# Altium schematic sheet preamp_chanel2_normal.SchDoc
size A4
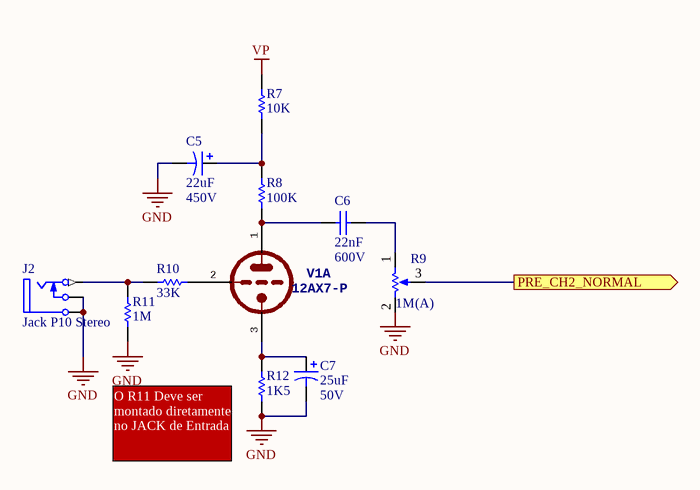
[diagram p0: preamp_chanel2_normal.SchDoc]

## Parts
C5  value 22uF  Voltage: 450V  [RAD-POL-7.6-15]  (hidden comment: Cap Pol Rad)
C6  value 22nF  Voltage: 600V  [ORANGE-DROP-100nF]  (hidden comment: Orange Drop Capacitor)
C7  value 25uF  Voltage: 50V  [AXIAL-POL-30mm]  (hidden comment: Cap Pol Axial)
J2  Jack P10 Stereo  [JACK-STEREO-3PAD]
R7  value 10K  [AXIAL-0.6]  (hidden comment: Metal Film Resistor 1/2W)
R8  value 100K  [AXIAL-0.6]  (hidden comment: Metal Film Resistor 1/2W)
R9  value 1M  TYPE: (A)  [pot_alpha - 2.54mm]  (hidden comment: ALPHA Potentiometer)
R10  value 33K  [AXIAL-0.6]  (hidden comment: Metal Film Resistor 1/2W)
R11  value 1M  [AXIAL-0.6]  (hidden comment: Metal Film Resistor 1/2W)  (mechanical)
R12  value 1K5  [AXIAL-0.6]  (hidden comment: Metal Film Resistor 1/2W)
V1  12AX7-P  [NOVAL]  (part A of 3)

## Ports
PRE_CH2_NORMAL (out)

## Nets
GND: C5.2 C7.2 J2.2(TN) J2.5(S) R9.2(BOT) R11.1 R12.1
VP: R7.2
PRE_CH2_NORMAL: R9.3(TAP) ; port PRE_CH2_NORMAL
NetC5_1: C5.1 R7.1 R8.2
NetC6_1: C6.1 R8.1 V1.1(TA)
NetC6_2: C6.2 R9.1(TOP)
NetC7_1: C7.1 R12.2 V1.3(TK)
NetJ2_1: J2.1(T) R10.2 R11.2
NetR10_1: R10.1 V1.2(TG)

## Notes on the sheet
- (near R12) O R11 Deve ser montado diretamente no JACK de Entrada

## Library data of the parts
C5 = Cap Pol Rad: Polarized Capacitor (Axial); Published: 8-Jun-2000; LatestRevisionDate: 17-Jul-2002; LatestRevisionNote: Re-released for DXP Platform.; PackageReference: POLAR0.8; Publisher: Altium Limited; PackageDescription: Polarized Capacitor; 2 Leads
C6 = Cap-Orange-DROP-22nF-600V: Capacitor; Published: 8-Jun-2000; LatestRevisionDate: 17-Jul-2002; LatestRevisionNote: Re-released for DXP Platform.; PackageReference: RAD-0.3; Publisher: Altium Limited; PackageDescription: Radial Cap, Thru-Hole; 2 Leads; 0.3 in Pin Spacing
C7 = Cap Pol Axial: Polarized Capacitor Axial; Published: 8-Jun-2000; LatestRevisionDate: 12-Feb-2014; LatestRevisionNote: Re-released for DXP Platform.; PackageReference: POLAR0.8; Publisher: Whitesheep Amps; PackageDescription: Polarized Capacitor; 2 Leads
J2 = Jack P10 Stereo: Jack Socket, 1/4" [6.5mm], Thru-Hole, Vertical, 2-Conductor with Tip closed; PackageDocument: 2003; PCB_Layout: Complies with manufacturer's recommendation.; DrillAndSlotSize: Corresponds to nominal value.; LatestRevisionDate: 15-Jul-2004; LatestRevisionNote: Component Replaced & renamed from "Phonejack".; DatasheetDocument: 2003; PackageReference: S1VS_SNB; Publisher: Altium Limited; ComponentLink1Description: Manufacturer Link; ComponentLink1URL: http://www.cliffuk.co.uk/
R7 R8 R10-R12 = Res Metal Film 1/2W: Semiconductor Resistor; Published: 8-Jun-2000; LatestRevisionDate: 17-Jul-2002; LatestRevisionNote: 12-Fev-2014; PackageReference: AXIAL-0.6; Publisher: Whitesheep Amps; PackageDescription: Axial Device, Thru-Hole; 2 Leads; 0.5 in Pin Spacing; Power: 1/2W
R9 = alpha-pot: Potentiometer; Sim Note: Enter the Resistance value and the set point into parameter fields.; Set Position: 0.5; Published: 8-Jun-2000; LatestRevisionDate: 17-Jul-2002; LatestRevisionNote: Re-released for DXP Platform.; PackageReference: VR5; Publisher: Altium Limited; PackageDescription: Variable Resistor, Thru-Hole; 3 Leads